# Altium schematic sheet BIAS_IO.SchDoc
size A4; SheetNumber: 4; SheetTotal: 7
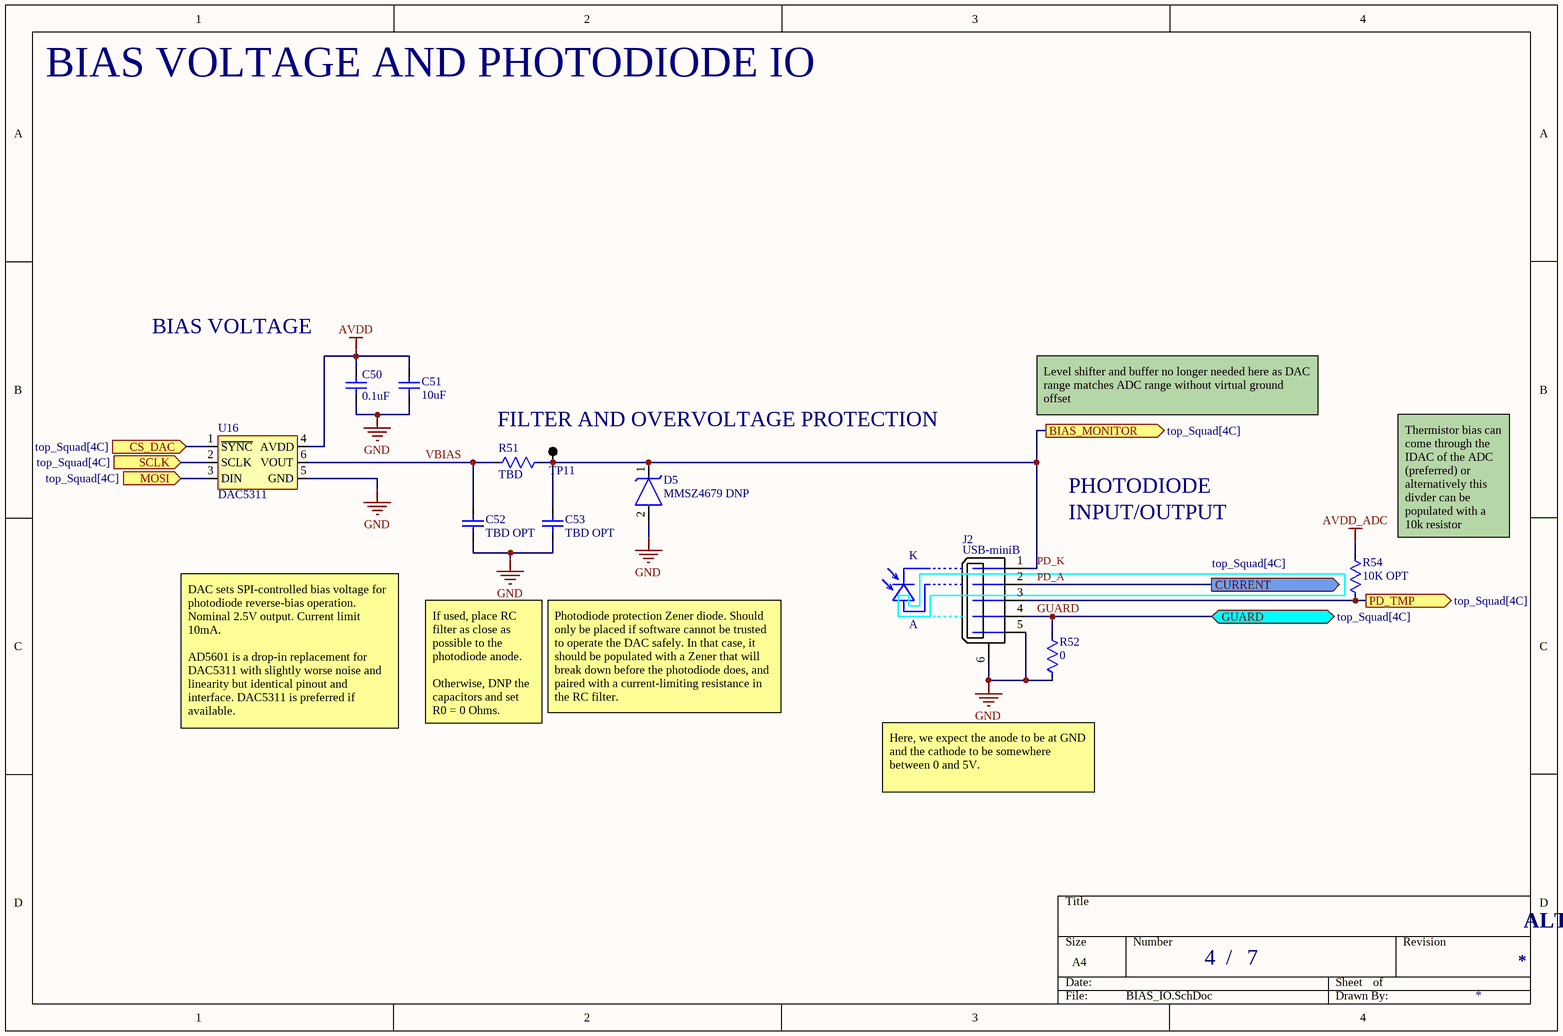
[diagram p0: BIAS_IO.SchDoc]

## Parts
C50  0.1uF  [CAP 0603 IPC MID DENSITY]
C51  10uF  [CAP 0805 IPC MID DENSITY]
C52  TBD OPT  [CAP 0603 IPC MID DENSITY]
C53  TBD OPT  [CAP 0603 IPC MID DENSITY]
D5  MMSZ4679 DNP  [SOD-123 ONSEMI SMALL PADS]
J2  USB-miniB  [USB_MINIB_RIGHTANGLE]
R51  TBD  [RES 0603 IPC MID DENSITY]
R52  0  [RES 0402 IPC MID DENSITY]
R54  10K OPT  [RES 0603 IPC MID DENSITY]
TP11  Testpoint  [TESTPOINT THT]  (value not drawn)  (no BOM)
U16  DAC5311  [SOT363-6 MID DENSITY]

## Ports
BIAS_MONITOR (out, see top_Squad[4C]), CS_DAC (in, see top_Squad[4C]), CURRENT (out, see top_Squad[4C]), GUARD (bidir, see top_Squad[4C]), MOSI (in, see top_Squad[4C]), PD_TMP (out, see top_Squad[4C]), SCLK (in, see top_Squad[4C])

## Nets
AVDD: C50.2 C51.2 U16.4(AVDD)
AVDD_ADC: R54.1
GND: C50.1 C51.1 C52.1 C53.1 D5.2(Anode) J2.5 J2.6(SHLD) R52.2 U16.5(GND)
CS_DAC: U16.1(~{SYNC}) ; port CS_DAC
GUARD: J2.4 R52.1 ; port GUARD
MOSI: U16.3(DIN) ; port MOSI
PD_A: J2.2 ; port CURRENT
PD_K: C53.2 D5.1(Cathode) J2.1 R51.1 TP11.1 ; port BIAS_MONITOR
PD_TMP: J2.3 R54.2 ; port PD_TMP
SCLK: U16.2(SCLK) ; port SCLK
VBIAS: C52.2 R51.2 U16.6(VOUT)

## Notes on the sheet
- BIAS VOLTAGE AND PHOTODIODE IO
- BIAS VOLTAGE
- FILTER AND OVERVOLTAGE PROTECTION
- Level shifter and buffer no longer needed here as DAC range matches ADC range without virtual ground offset
- PHOTODIODE
- K
- INPUT/OUTPUT
- (near R54) Thermistor bias can come through the IDAC of the ADC (preferred) or alternatively this divder can be populated with a 10k resistor
- A
- If used, place RC filter as close as possible to the photodiode anode.
  Otherwise, DNP the capacitors and set R0 = 0 Ohms.
- Photodiode protection Zener diode. Should only be placed if software cannot be trusted to operate the DAC safely. In that case, it should be populated with a Zener that will break down before the photodiode does, and paired with a current-limiting resistance in the RC filter.
- DAC sets SPI-controlled bias voltage for photodiode reverse-bias operation. Nominal 2.5V output. Current limit 10mA.
  AD5601 is a drop-in replacement for DAC5311 with slightly worse noise and linearity but identical pinout and interface. DAC5311 is preferred if available.
- (near R52) Here, we expect the anode to be at GND and the cathode to be somewhere between 0 and 5V.
- /
- ALTAIR PhotoDiode ReadOut (PDRO) - Squad

## Library data of the parts
C50 = CAP: Kemet C0603C104K5RACAUTO - Cap Ceramic 0.1uF 50V X7R 10% 0603 125C Paper T/R; MF: Kemet; MP: C0603C104K5RACAUTO
C51 = CAP: Murata GRM21BR61E106KA73L - Cap Ceramic 10uF 10% 25V X5R 0805; MF: Murata; MP: GRM21BR61E106KA73L
C52 C53 = CAP: Murata GRT188R61H105KE13D - Cap Ceramic 1uF 10% 50V X5R 0603 (Placeholder); MF: Murata; MP: GRT188R61H105KE13D
D5 = Zener: DIODE ZENER SOD123; MF: onsemi; MP: MMSZ4679T1G
J2 = USB-miniB: Conn Mini-USB RCP 5 POS Solder ST Thru-Hole 5 Terminal 1 Port; Number of Positions: 5; Gender: Female; MF: Amphenol Commercial; MP: UE25BE5510H; RoHS: Yes; Category: USB Connectors; Stock 1: 6446; Mount: Through Hole; Color: Black; Contact Material: Copper Alloy; Contact Plating: Gold; Number of Contacts: 5; Termination: PCB; Features: High Temperature; Lead Free: Lead Free; Flammability Rating: UL94 V-0; ComponentLink1URL: http://components.arrow.com/part/dataview/0323_00956300?src-supplier=Arrow+Europe; ComponentLink1Description: http://components.arrow.com/part/dataview/0323_00956300?src-supplier=Arrow+Europe; ComponentLink2URL: http://www.alliedelec.com/m/d/e7e3d7a920045eebbdef787e60d8b001.pdf?src-supplier=Allied+Electronics; ComponentLink2Description: http://www.alliedelec.com/m/d/e7e3d7a920045eebbdef787e60d8b001.pdf?src-supplier=Allied+Electronics; ComponentLink3URL: https://www.amphenolcanada.com/ProductSearch/drawings/AC/UE25BEX510X.pdf?src-supplier=Digi-Key; ComponentLink3Description: https://www.amphenolcanada.com/ProductSearch/drawings/AC/UE25BEX510X.pdf?src-supplier=Digi-Key; Supplier 1: Digi-Key; Supplier Part Number 1: UE25BE5510H-ND
R51 R52 R54 = RES: Yageo RC0402JR-070RL - Res 0 Ohms 1/16W SMD 0402; MF: YAGEO; MP: RC0402JR-070RL
U16 = DAC5311: DAC 8bit 1 channel SPI Supply Reference Buffered Voltage; MF: Texas Instruments; MP: DAC5311IDCKR